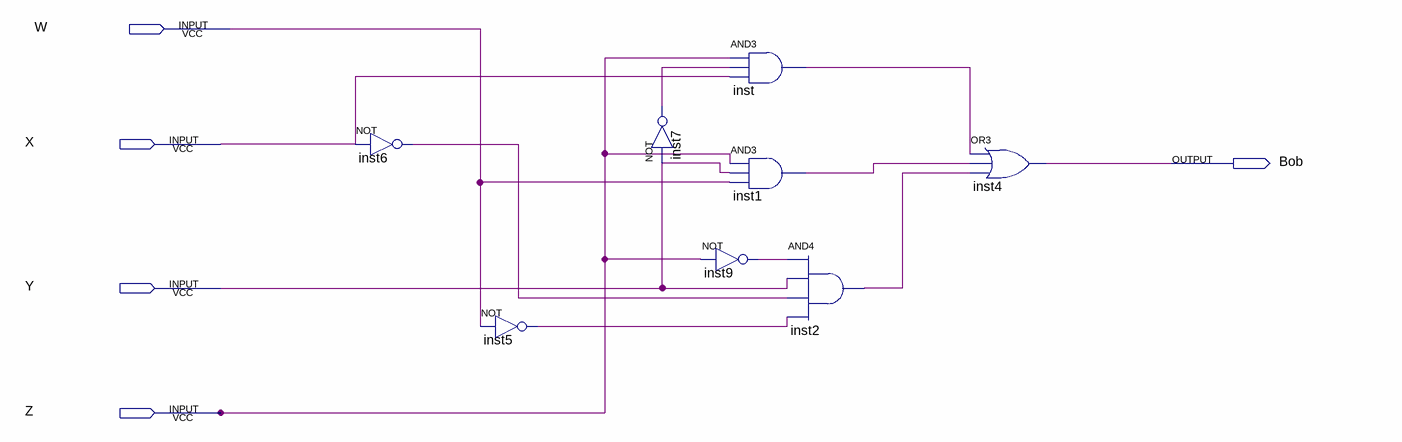
[diagram p0: schematic sheet]
// Quartus schematic miniStep4.bdf as structural Verilog: 8 symbols, 5 pins
module miniStep4 (
  input  W,
  input  X,
  input  Y,
  input  Z,
  output Bob
);

  wire inst1_out, inst2_out, inst5_out, inst6_out, inst7_out, inst9_out, inst_out;

  not inst6 (inst6_out, X);
  not inst5 (inst5_out, W);
  not inst7 (inst7_out, Y);
  and inst (inst_out, Z, inst7_out, X);
  and inst1 (inst1_out, Z, Y, W);
  not inst9 (inst9_out, Z);
  and inst2 (inst2_out, inst9_out, Y, inst6_out, inst5_out);
  or inst4 (Bob, inst_out, inst1_out, inst2_out);
endmodule
